# Altium schematic sheet Encoder_DC_Mot.SchDoc: DC Motor Speed Encoder
size B; Date: 2015-01-23; Author: Marcin Czajkowski; Organization: Marcin Czajkowski; Address1: SN: 3547684; Address2: ESE-Year2; Address3: Conestoga College; Address4: Project IV; DocumentNumber: 9; Revision: B; SheetNumber: 9; SheetTotal: 14
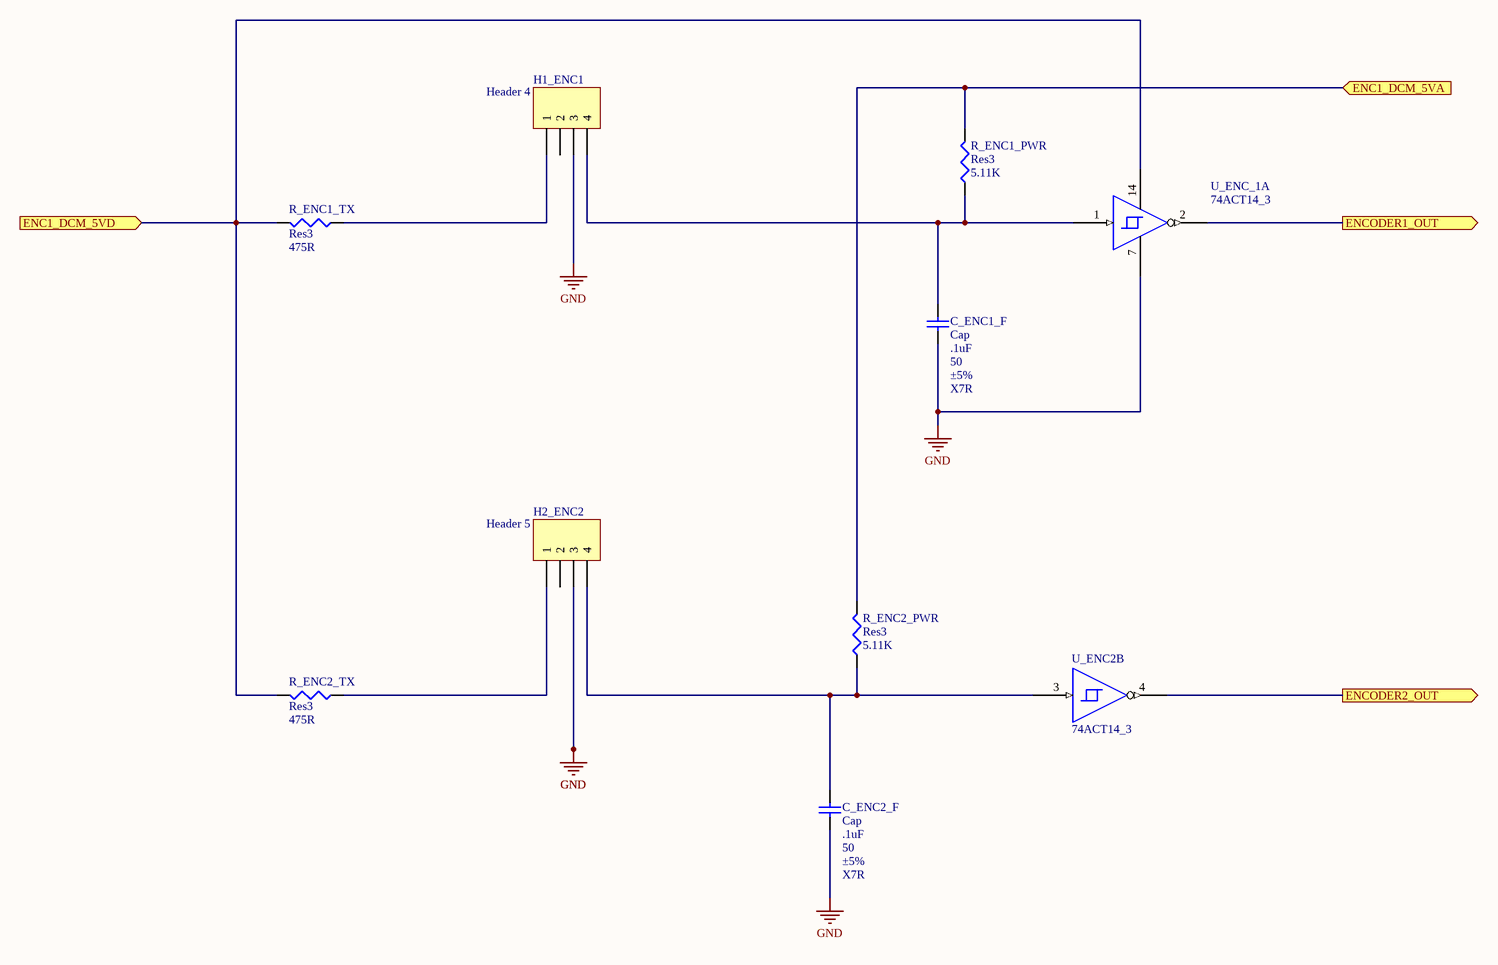
[diagram p0: Encoder_DC_Mot.SchDoc]

## Parts
C_ENC1_F  Cap  value .1uF  WV: 50  Tolerance: ±5%  Type: X7R  [CAPC2012X09M]
C_ENC2_F  Cap  value .1uF  WV: 50  Tolerance: ±5%  Type: X7R  [CAPC2012X09M]
H1_ENC1  Header 4  [HDR1X4]
H2_ENC2  Header 5  [HDR1X4]
R_ENC1_PWR  Res3  value 5.11K  [RESC2112X05M]
R_ENC1_TX  Res3  value 475R  [RESC2112X05M]
R_ENC2_PWR  Res3  value 5.11K  [RESC2112X05M]
R_ENC2_TX  Res3  value 475R  [RESC2112X05M]
U_ENC2  74ACT14_3  [SOIC127P600X175-14M]  (part B of 6)
U_ENC_1  74ACT14_3  [SOIC127P600X175-14M]  (part A of 6)

## Ports
ENC1_DCM_5VA (in), ENC1_DCM_5VD (in), ENCODER1_OUT (out), ENCODER2_OUT (out)

## Nets
GND: C_ENC1_F.1 C_ENC2_F.1 H1_ENC1.3 H2_ENC2.3 U_ENC_1.7(GND_POWER)
ENC1_DCM_5VA: R_ENC1_PWR.2 R_ENC2_PWR.2 ; port ENC1_DCM_5VA
ENC1_DCM_5VD: R_ENC1_TX.2 R_ENC2_TX.2 U_ENC_1.14(VCC) ; port ENC1_DCM_5VD
ENCODER1_OUT: U_ENC_1.2(Y) ; port ENCODER1_OUT
ENCODER2_OUT: U_ENC2.4(Y) ; port ENCODER2_OUT
NetC_ENC1_F_2: C_ENC1_F.2 H1_ENC1.4 R_ENC1_PWR.1 U_ENC_1.1(A)
NetC_ENC2_F_2: C_ENC2_F.2 H2_ENC2.4 R_ENC2_PWR.1 U_ENC2.3(A)
NetH1_ENC1_1: H1_ENC1.1 R_ENC1_TX.1
NetH2_ENC2_1: H2_ENC2.1 R_ENC2_TX.1

Not connected (* = marked no-connect by the designer): H1_ENC1 2; H2_ENC2 2

## Notes on the sheet
- ESE
- is the sole property of ESE. Any reproduction
- The Information Contained in this drawing
- Schematic P/N and Name
- Sheet Name
- 299 Doon Valley Drive
- Kitchener, ON N2G 4M4
- Canada
- Approved
- in part or in whole without the written
- permission of ESE is strictly prohibited.
- APPROVALS
- DATE
- Size
- Scale
- B
- NTS
- Bare PCB P/N
- Date
- Sheet
- Rev.
- Checked
- Engineer
- of

## Library data of the parts
C_ENC1_F C_ENC2_F = CAP-X7R-.1uF-50V-±5%: CAP CER .1uF 50v X7R 0805; MPN: C0805C104J5RACTU; PN: 399-1171-1-ND; Name: CAP-X7R-.1uF-50V-±5%; URL: http://www.digikey.ca/product-detail/en/C0805C104J5RACTU/399-1171-1-ND
H1_ENC1 H2_ENC2 = Header 4: Header, 4-Pin; MPN: PEC04SFAN; PN: S1212E-04-ND; URL: http://www.digikey.ca/product-detail/en/PEC04SFAN/S1212E-04-ND
R_ENC1_PWR R_ENC2_PWR = Resistor_5.11K: RES SMD 5.11K OHM 1% 1/8W 0805; MPN: CRCW08055K11FKEA; PN: 541-5.11KCCT-ND; Name: Resistor_5.11K; URL: http://www.digikey.ca/product-detail/en/CRCW08055K11FKEA/541-5.11KCCT-ND
R_ENC1_TX R_ENC2_TX = Resistor_475R: RES SMD 475R OHM 1% 1/8W 0805; MPN: CRCW0805475RFKEA; PN: 541-475CCT-ND; Name: Resistor_475R; URL: http://www.digikey.ca/product-detail/en/CRCW0805475RFKEA/541-475CCT-ND
U_ENC2 U_ENC_1 = 74ACT14_3: IC INVERTER HEX SCHMITT 14SOIC; MPN: 74ACT14SCX; PN: 74ACT14SCXCT-ND; URL: http://www.digikey.ca/product-detail/en/74ACT14SCX/74ACT14SCXCT-ND